# Altium schematic sheet Power.SchDoc
size A3; SheetNumber: 2; SheetTotal: 5
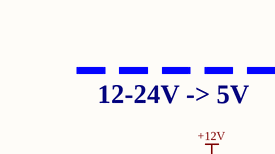
[diagram p0: Power.SchDoc, top left]
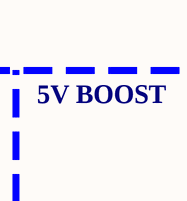
[diagram p1: Power.SchDoc, top right]
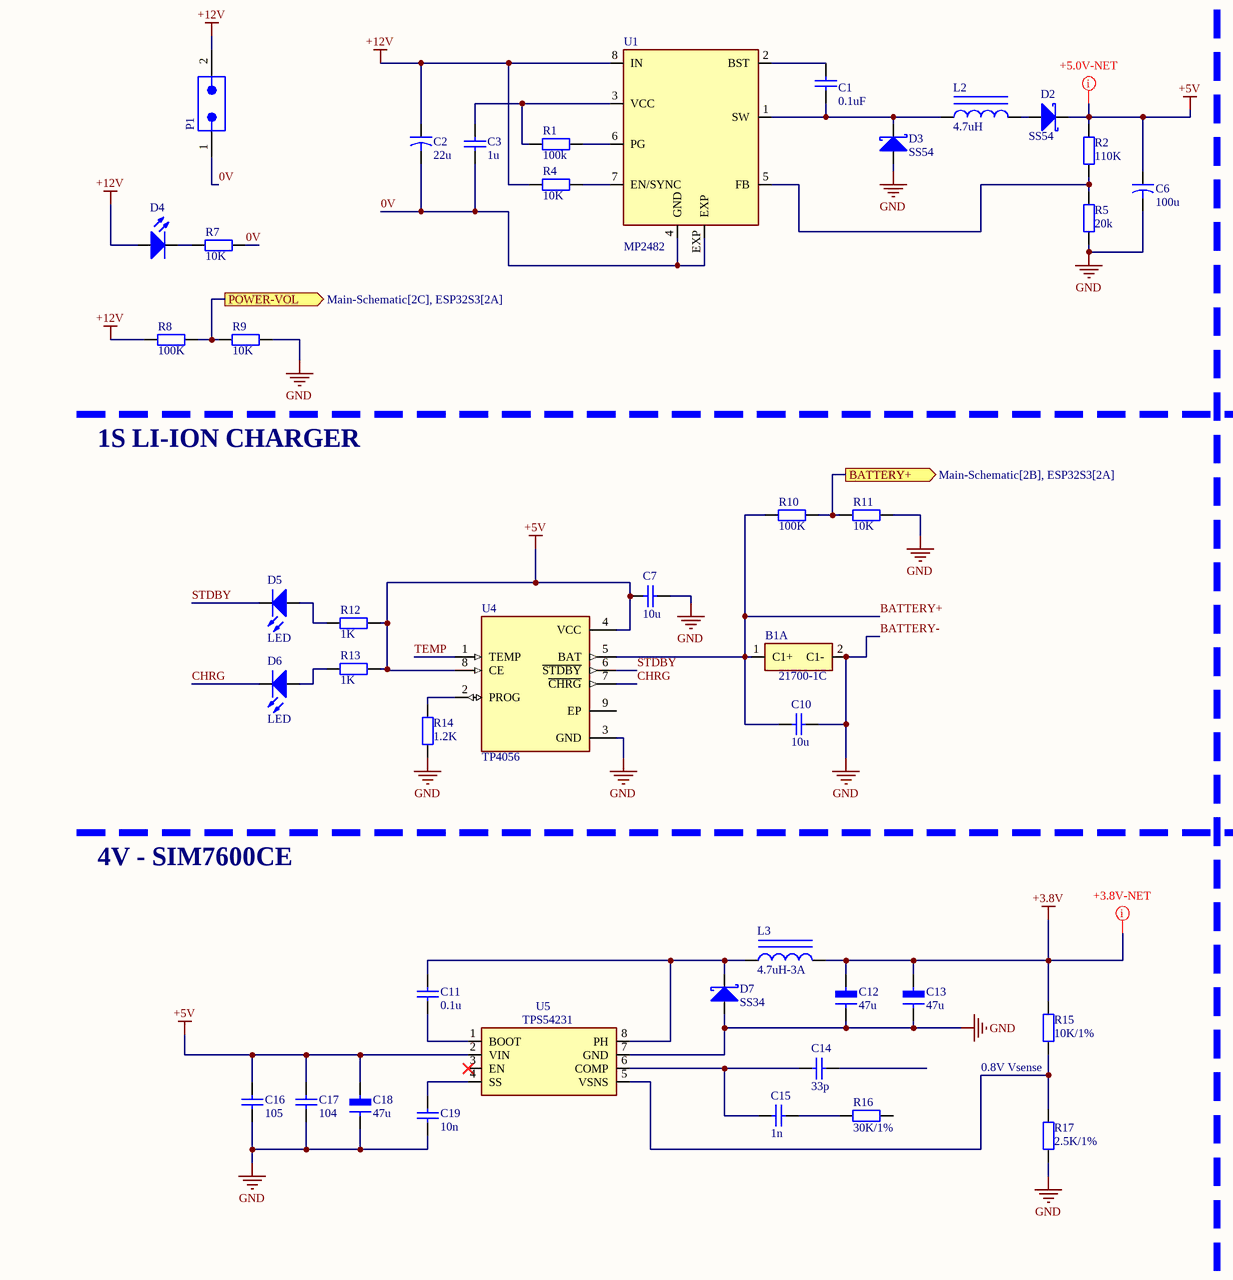
[diagram p2: Power.SchDoc, bottom left]
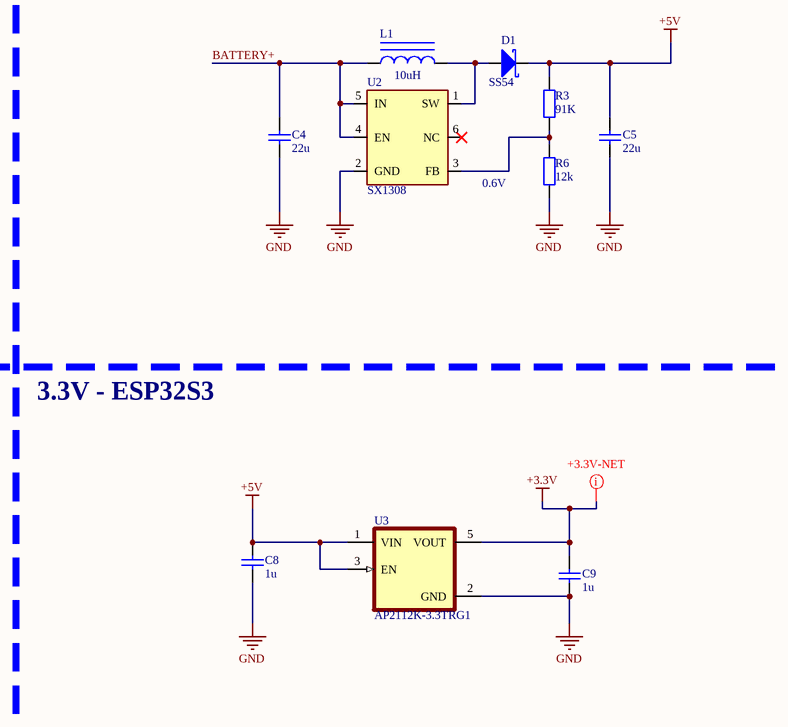
[diagram p3: Power.SchDoc, bottom right]

## Parts
B1  21700-1C  [18650-2C]  (part A of 2)
C1  0.1uF  [CAP_1206]
C2  22u  [ALU-SMD-CAP-D-6.3mm]
C3  1u  [CAP_0603]
C4  22u  [CAP_0603]
C5  22u  [CAP_0603]
C6  100u  [ALU-SMD-CAP-D-6.3mm]
C7  10u  [CAP_0603]
C8  1u  [CAP_0603]
C9  1u  [CAP_0603]
C10  10u  [CAP_0603]
C11  0.1u  [CAP_0603]
C12  47u  [C_Tanta_C6032]
C13  47u  [C_Tanta_C6032]
C14  33p  [CAP_0603]
C15  1n  [CAP_0603]
C16  105  [CAP_0603]
C17  104  [CAP_0603]
C18  47u  [C_Tanta_C6032]
C19  10n  [CAP_0603]
D1  SS54  [SMB]
D2  SS54  [SMB]
D3  SS54  [SMB]
D4  (no value)  [LED-0805-Red]
D5  LED  [LED-0805-Red]
D6  LED  [LED-0805-Red]
D7  SS34  [SMA]
L1  10uH  [CD75]
L2  4.7uH  [IND-0520]
L3  4.7uH-3A  [IND_CDRH127-4R7NC_SUM]
P1  64900229522  [64900229522]  (value not drawn)
R1  100k  [RES_0603]
R2  110K  [RES_0603]
R3  91K  [RES_0603]
R4  10K  [RES_0603]
R5  20k  [RES_0603]
R6  12k  [RES_0603]
R7  10K  [RES_0603]
R8  100K  [RES_0603]
R9  10K  [RES_0603]
R10  100K  [RES_0603]
R11  10K  [RES_0603]
R12  1K  [RES_0603]
R13  1K  [RES_0603]
R14  1.2K  [RES_0603]
R15  10K/1%  [RES_0603]
R16  30K/1%  [RES_0603]
R17  2.5K/1%  [RES_0603]
U1  MP2482  [SOP8-P]
U2  SX1308  [SOT23-6]
U3  AP2112K-3.3TRG1  [SOT95P285X140-5N]
U4  TP4056  [SOP127P600X175-9N]
U5  TPS54231  [SOIC8-1.75H]

## Ports
BATTERY+ (out, see Main-Schematic[2B], ESP32S3[2A]), POWER-VOL (out, see Main-Schematic[2C], ESP32S3[2A])

## Nets
+3.3V: C9.2 U3.5(VOUT)
+3.8V: C12.1 C13.1 L3.2 R15.2
+5V: C5.2 C6.1 C7.2 C8.2 C16.2 C17.2 C18.1 D1.2(K) D2.2(K) R2.2 R3.2 R12.2 R13.2 U3.1(VIN) U3.3(EN) U4.4(VCC) U4.8(CE) U5.2(VIN)
+12V: C2.1 D4.1(A) P1.2 R4.2 R8.1 U1.8(IN)
BATTERY-: B1.2(C1-) C4.1 C5.1 C6.2 C7.1 C8.1 C9.1 C10.1 C12.2 C13.2 C16.1 C17.1 C18.2 C19.1 D3.1(A) D7.1(A) R5.1 R6.1 R9.2 R11.2 R14.2 R17.1 U2.2(GND) U3.2(GND) U4.3(GND) U5.7(GND)  [also labelled GND]
0V: C2.2 C3.1 P1.1 R7.2 U1.4(GND) U1.EXP
BATTERY+: B1.1(C1+) C4.2 C10.2 L1.1 R10.1 U2.4(EN) U2.5(IN) U4.5(BAT)
BATTERY+: R10.2 R11.1 ; port BATTERY+  [a separate net that carries the same name]
CHRG: D6.2(K) U4.7(~{CHRG})
POWER-VOL: R8.2 R9.1 ; port POWER-VOL
STDBY: D5.2(K) U4.6(~{STDBY})
TEMP: U4.1(TEMP)
NetC1_1: C1.1 U1.2(BST)
NetC1_2: C1.2 D3.2(K) L2.1 U1.1(SW)
NetC3_2: C3.2 R1.2 U1.3(VCC)
NetC11_1: C11.1 U5.1(BOOT)
NetC11_2: C11.2 D7.2(K) L3.1 U5.8(PH)
NetC14_2: C14.2 C15.2 U5.6(COMP)
NetC15_1: C15.1 R16.2
NetC19_2: C19.2 U5.4(SS)
NetD1_1: D1.1(A) L1.2 U2.1(SW)
NetD2_1: D2.1(A) L2.2
NetD4_2: D4.2(K) R7.1
NetD5_1: D5.1(A) R12.1
NetD6_1: D6.1(A) R13.1
NetR1_1: R1.1 U1.6(PG)
NetR2_1: R2.1 R5.2 U1.5(FB)
NetR3_1: R3.1 R6.2 U2.3(FB)
NetR4_1: R4.1 U1.7(EN/SYNC)
NetR14_1: R14.1 U4.2(PROG)
NetR15_1: R15.1 R17.2 U5.5(VSNS)

Not connected (* = marked no-connect by the designer): C14 1; R16 1; U2 6(NC)*; U4 9(EP); U5 3(EN)*

## Layout directives
net class POWER: +3.3V, +3.8V, +5V

## Notes on the sheet
- 12-24V -> 5V
- 5V BOOST
- 0.6V
- 1S LI-ION CHARGER
- 3.3V - ESP32S3
- 4V - SIM7600CE
- (near R15) 0.8V Vsense

## Library data of the parts
B1 = 18650-2C
C1 C3-C5 C7-C11 C14-C17 C19 = Cap_NP: Non-polarized capacitor
C2 C6 = Cap_Alu: Polarized aluminum capacitor
C12 C13 C18 = Cap_Tatan: Polarized tantaLum capacitor
D1-D3 D7 = S-Diode: Schottky diode
D4-D6 = LED: Light Emitting Diode
L1-L3 = Inductor Iron: Magnetic-Core Inductor; Published: 24-Mar-1999; LatestRevisionDate: 17-Jul-2002; LatestRevisionNote: Re-released for DXP Platform.; PackageReference: AXIAL-0.9; Publisher: Altium Limited; PackageDescription: Axial Device, Thru-Hole; 2 Leads; 0.9 in Pin Spacing
P1 = 64900229522: WR-MPC4 THT Male Right Angled Header, pitch 4.2mm, 2p; Manufacturer: Wurth Elektronik; Contact Resistance: 10mOhm; Insulation Resistance: 1000MOhm; Rated Current: 9A; Working Voltage: 600VAC; Manufacturer Part Number: 64900229522; Category: Wire-to-Board Connectors; Match Code: WR-MPC4; ComponentLink1Description: Website Link; ComponentLink1URL: https://www.we-online.com/redexpert/article/64900229522?ad; ComponentLink2Description: Datasheet Link; ComponentLink2URL: https://www.we-online.com/redexpert/spec/64900229522?ad; Mount: Through Hole; Min Operating Temperature: -40°C; Max Operating Temperature: 105°C; Packaging: Tray; Gender: Male; Number of Pins: 2; Number of Rows: 2; Orientation: Right Angled; Pitch: 4.2mm
R1-R17 = Resistor
U1 = MP2482: 5A, 30V, 420kHz Step-Down Converter; MF: Monolithic Power Systems Inc.; SnapEDA_Link: https://www.snapeda.com/parts/MP2482/Monolithic+Power+Systems+Inc./view-part/?ref=snap; Package: None; Value: *; MP: MP2482; Check_prices: https://www.snapeda.com/parts/MP2482/Monolithic+Power+Systems+Inc./view-part/?ref=eda
U2 = SX1308: 1.2MHz 2A Step Up Converter 85T
U3 = AP2112K-3.3TRG1: Linear Voltage Regulator IC Positive Fixed 1 Output 600mA SOT-25; MF: Diodes Inc.; Value: *; Purchase-URL: https://pricing.snapeda.com/search/part/AP2112K-3.3TRG1/?ref=eda; Package: SOT-753 Diodes Inc.; Availability: In Stock; Check_prices: https://www.snapeda.com/parts/AP2112K-3.3TRG1/Diodes+Inc./view-part/?ref=eda; Price: None; SnapEDA_Link: https://www.snapeda.com/parts/AP2112K-3.3TRG1/Diodes+Inc./view-part/?ref=snap; MP: AP2112K-3.3TRG1
U4 = TP4056: Complete single cell Li-Ion battery with a constant current / constant voltage linear charger; MF: NanJing Top Power ASIC Corp.; Check_prices: https://www.snapeda.com/parts/TP4056/NanJing+Top+Power+ASIC+Corp./view-part/?ref=eda; SnapEDA_Link: https://www.snapeda.com/parts/TP4056/NanJing+Top+Power+ASIC+Corp./view-part/?ref=snap; Price: None; Availability: Not in stock; Package: Package; MP: TP4056; Value: *
U5 = TPS54231: 2-A, 28-V Input, Step-Down DC-DC Converter